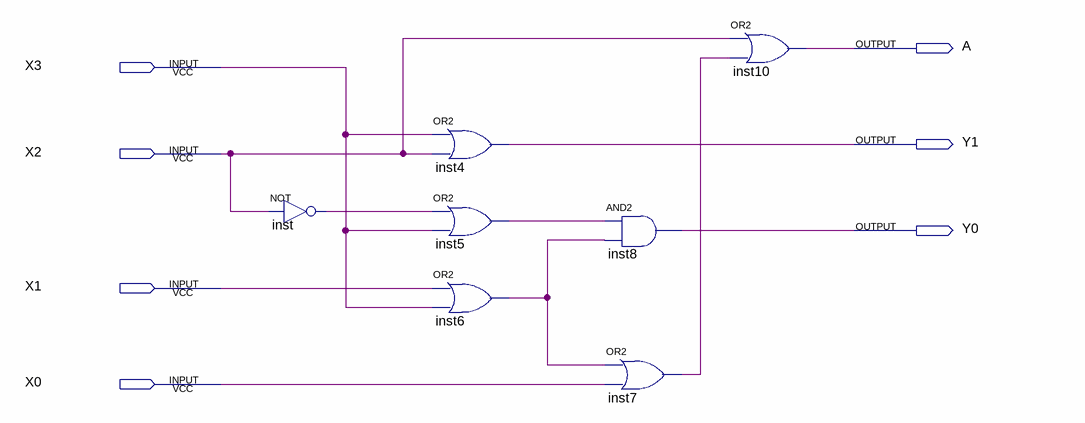
[diagram p0: schematic sheet]
// Quartus schematic q4.bdf as structural Verilog: 7 symbols, 7 pins
module q4 (
  input  X3,
  input  X2,
  input  X1,
  input  X0,
  output A,
  output Y1,
  output Y0
);

  wire inst5_out, inst6_out, inst7_out, inst_out;

  not inst (inst_out, X2);
  or inst4 (Y1, X3, X2);
  or inst5 (inst5_out, inst_out, X3);
  or inst6 (inst6_out, X1, X3);
  and inst8 (Y0, inst5_out, inst6_out);
  or inst7 (inst7_out, inst6_out, X0);
  or inst10 (A, X2, inst7_out);
endmodule
